# Altium project 恒温烤箱控制系统.PrjPCB
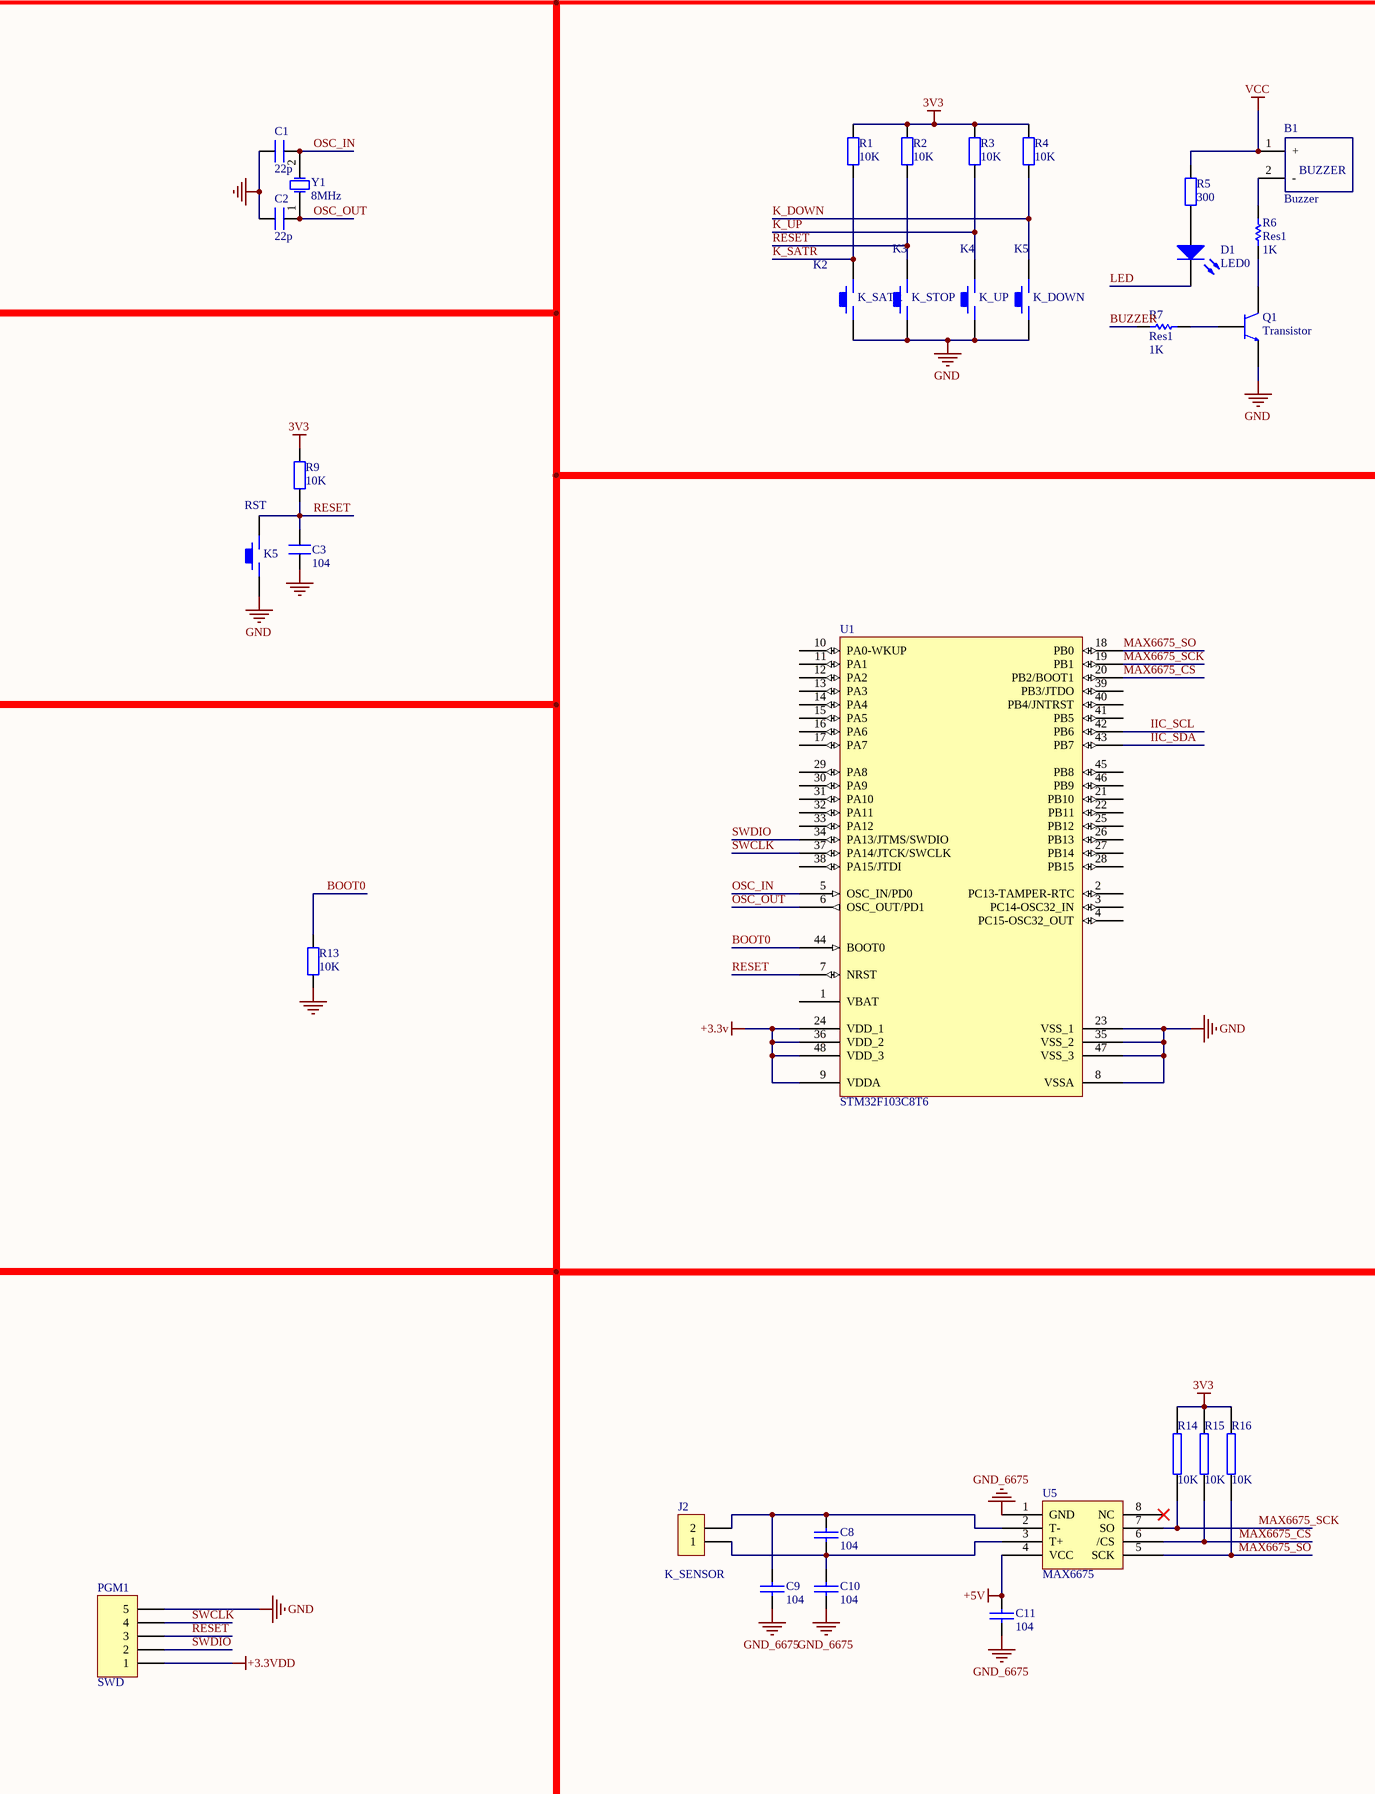
[diagram p0: 原理图.SchDoc, left]
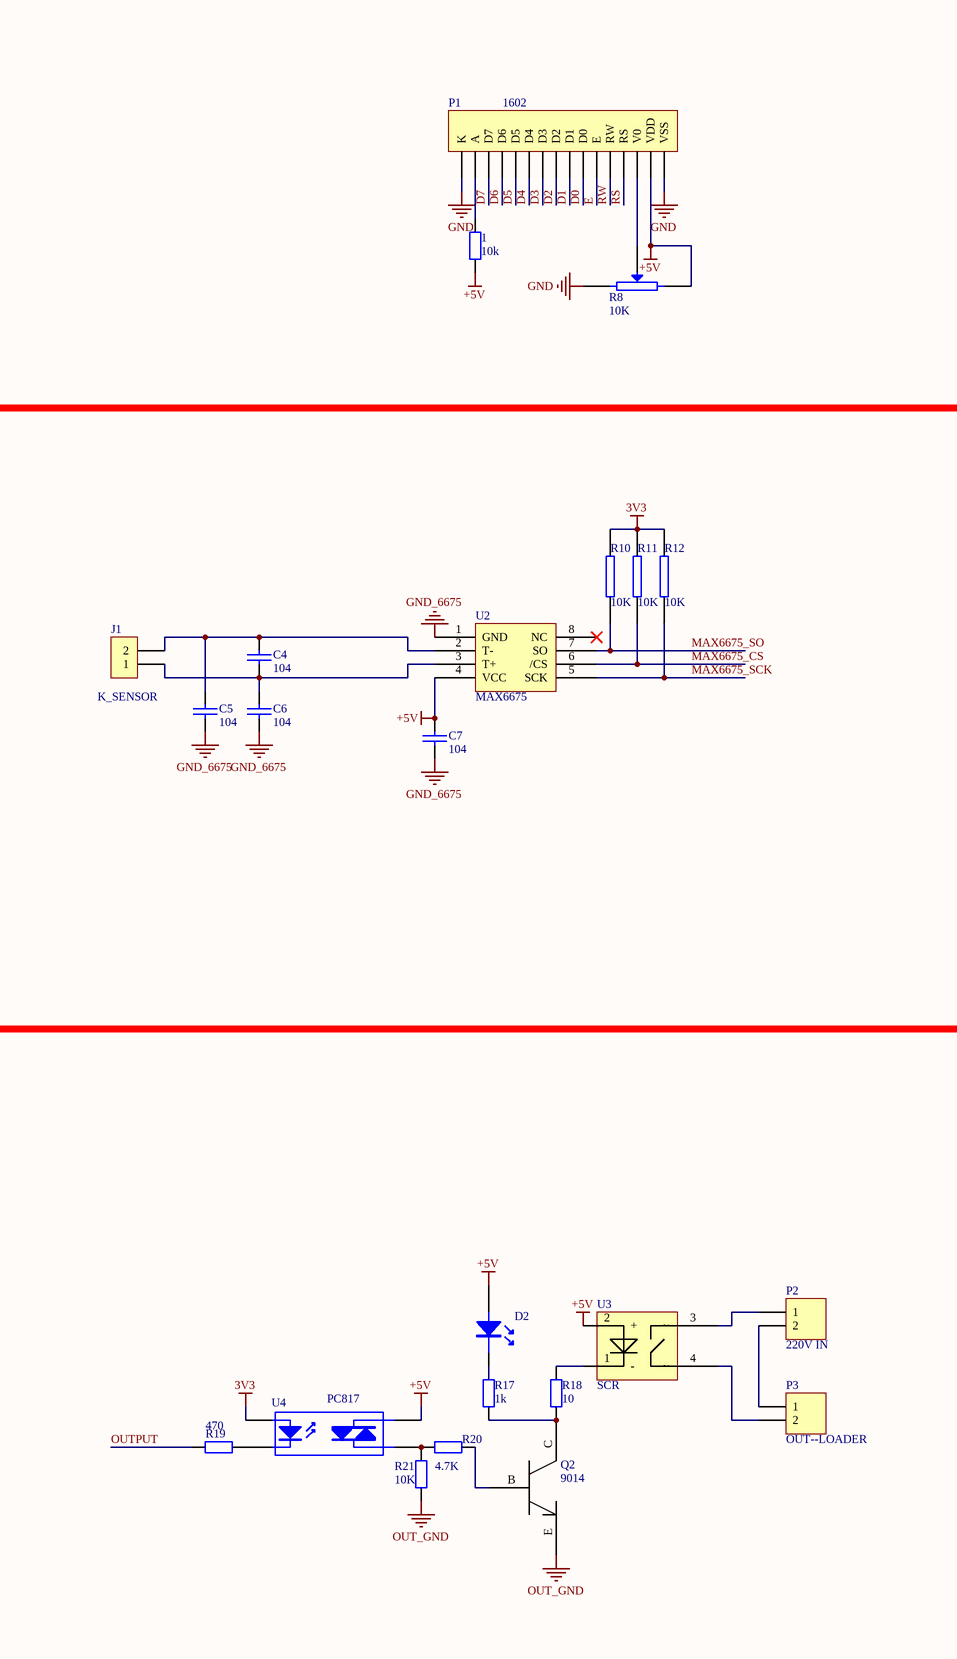
[diagram p1: 原理图.SchDoc, right]
1 sheet, 55 parts. Net scope: global (net labels, ports and power ports of the same name join across sheets).
Board file: PCB.PcbDoc

## Sheet 原理图.SchDoc
size A2

### Parts
1  10k  [AXIAL-0.4]
B1  Buzzer  [BUZZER]
C1  22p  [1206]
C2  22p  [1206]
C3  104  [1206]
C4  104  [1206]
C5  104  [1206]
C6  104  [1206]
C7  104  [1206]
C8  104  [1206]
C9  104  [1206]
C10  104  [1206]
C11  104  [1206]
D1  LED0  [LED-0]
D2  (no value)  [LED]
J1  K_SENSOR  [OUT_CJ]
J2  K_SENSOR  [OUT_CJ]
K5  RST  [KEY_M]
K_DOWN  K5  [KEY_M]
K_SATR  K2  [KEY_M]
K_STOP  K3  [KEY_M]
K_UP  K4  [KEY_M]
P1  1602  [HDR1X16]
P2  220V IN  [OUT_CJ]
P3  OUT--LOADER  [OUT_CJ]
PGM1  SWD  [HX2.54-5p]
Q1  Transistor  [SOT23_TR]
Q2  9014  [9014]
R1  10K  [1206]
R2  10K  [1206]
R3  10K  [1206]
R4  10K  [1206]
R5  300  [AXIAL-0.4]
R6  Res1  value 1K  [SMD0805_RES]
R7  Res1  value 1K  [SMD0805_RES]
R8  10K  [VR]
R9  10K  [1206]
R10  10K  [1206]
R11  10K  [1206]
R12  10K  [1206]
R13  10K  [1206]
R14  10K  [1206]
R15  10K  [1206]
R16  10K  [1206]
R17  1k  [1206]
R18  10  [1206]
R19  470  [1206]
R20  4.7K  [1206]
R21  10K  [1206]
U1  STM32F103C8T6  [LQFP48_N]
U2  MAX6675  [SO-8]
U3  SCR  [SCR]
U4  PC817  [pc817]
U5  MAX6675  [SO-8]
Y1  8MHz  [XTAL_US]

### Nets
3V3: R1.2 R2.2 R3.2 R4.2 R9.1 R10.2 R11.2 R12.2 R14.2 R15.2 R16.2 U4.1(A)
+3.3v: U1.9(VDDA) U1.24(VDD_1) U1.36(VDD_2) U1.48(VDD_3)
+3.3VDD: PGM1.1
+5V: 1.1 C7.1 C11.1 D2.A P1.2(VDD) R8.2 U2.4(VCC) U3.2(+) U4.3(A/K) U5.4(VCC)
GND: C1.2 C2.1 C3.2 K5.1 K_DOWN.1 K_SATR.1 K_STOP.1 K_UP.1 P1.1(VSS) P1.16(K) PGM1.5 Q1.2 R8.1 R13.2 U1.8(VSSA) U1.23(VSS_1) U1.35(VSS_2) U1.47(VSS_3)
GND_6675: C5.2 C6.2 C7.2 C9.2 C10.2 C11.2 U2.1(GND) U5.1(GND)
OUT_GND: Q2.E R21.1
VCC: B1.1(+) R5.2
BOOT0: R13.1 U1.44(BOOT0)
BUZZER: R7.1
D0: P1.7(D0)
D1: P1.8(D1)
D2: P1.9(D2)
D3: P1.10(D3)
D4: P1.11(D4)
D5: P1.12(D5)
D6: P1.13(D6)
D7: P1.14(D7)
E: P1.6(E)
IIC_SCL: U1.42(PB6)
IIC_SDA: U1.43(PB7)
K_DOWN: K_DOWN.2 R4.1
K_SATR: K_SATR.2 R1.1
K_UP: K_UP.2 R3.1
LED: D1.2(K)
MAX6675_CS: R11.1 R15.1 U1.20(PB2/BOOT1) U2.6(/CS) U5.6(/CS)
MAX6675_SCK: R12.1 R14.1 U1.19(PB1) U2.5(SCK) U5.7(SO)
MAX6675_SO: R10.1 R16.1 U1.18(PB0) U2.7(SO) U5.5(SCK)
OSC_IN: C1.1 U1.5(OSC_IN/PD0) Y1.2(OSC2)
OSC_OUT: C2.2 U1.6(OSC_OUT/PD1) Y1.1(OSC1)
OUTPUT: R19.2
RESET: C3.1 K5.2 K_STOP.2 PGM1.3 R2.1 R9.2 U1.7(NRST)
RS: P1.4(RS)
RW: P1.5(RW)
SWCLK: PGM1.4 U1.37(PA14/JTCK/SWCLK)
SWDIO: PGM1.2 U1.34(PA13/JTMS/SWDIO)
Net1_2: 1.2 P1.15(A)
NetB1_2: B1.2(-) R6.2
NetC4_1: C4.1 C5.1 J1.2 U2.2(T-)
NetC4_2: C4.2 C6.1 J1.1 U2.3(T+)
NetC8_1: C8.1 C9.1 J2.2 U5.2(T-)
NetC8_2: C8.2 C10.1 J2.1 U5.3(T+)
NetD1_1: D1.1(A) R5.1
NetD2_K: D2.K R17.2
NetP1_3: P1.3(V0) R8.3(W)
NetP2_1: P2.1 U3.3
NetP2_2: P2.2 P3.1
NetP3_2: P3.2 U3.4
NetQ1_1: Q1.1 R7.2
NetQ1_3: Q1.3 R6.1
NetQ2_B: Q2.B R20.1
NetQ2_C: Q2.C R17.1 R18.1
NetR18_2: R18.2 U3.1(-)
NetR19_1: R19.1 U4.2(K)
NetR20_2: R20.2 R21.2 U4.4(A/K)

Not connected (* = marked no-connect by the designer): U1 1(VBAT) 2(PC13-TAMPER-RTC) 3(PC14-OSC32_IN) 4(PC15-OSC32_OUT) 10(PA0-WKUP) 11(PA1) 12(PA2) 13(PA3) 14(PA4) 15(PA5) 16(PA6) 17(PA7) 21(PB10) 22(PB11) 25(PB12) 26(PB13) 27(PB14) 28(PB15) 29(PA8) 30(PA9) 31(PA10) 32(PA11) 33(PA12) 38(PA15/JTDI) 39(PB3/JTDO) 40(PB4/JNTRST) 41(PB5) 45(PB8) 46(PB9); U2 8(NC)*; U5 8(NC)*

### Notes on the sheet
- (in symbol Buzzer) BUZZER

### Library data of the parts
1 R1-R5 R9 R13 R21 = Res2: Resistor; Published: 8-Jun-2000; LatestRevisionDate: 17-Jul-2002; LatestRevisionNote: Re-released for DXP Platform.; PackageReference: AXIAL-0.4; Publisher: Altium Limited; PackageDescription: Axial Device, Thru-Hole; 2 Leads; 0.4 in Pin Spacing
  R1-R4 R13 R21: Value: 10K
C1-C3 = C
C4-C11 = 普通电容: Capacitor
D1 = LED0: Typical INFRARED GaAs LED; Published: 8-Jun-2000; LatestRevisionDate: 08-Jul-2005; LatestRevisionNote: Mech Layer 1 removed.; PackageReference: LED-0; Publisher: Altium Limited; PackageDescription: LED; 2 Leads
D2 = 发光二极管
J1 J2 = CON2: Connector
K5 K_DOWN K_SATR K_STOP K_UP = KEY_M
P1 = Header 16: Header, 16-Pin; LatestRevisionDate: 17-Jul-2002; LatestRevisionNote: Re-released for DXP Platform.; Publisher: Altium Limited
P2 P3 = Header 2: Header, 2-Pin; LatestRevisionDate: 17-Jul-2002; LatestRevisionNote: Re-released for DXP Platform.; Publisher: Altium Limited
PGM1 = Header 5: Header, 5-Pin; LatestRevisionDate: 17-Jul-2002; LatestRevisionNote: Re-released for DXP Platform.; Publisher: Altium Limited
Q1 = NPN_Transistor_SOT23
R6 R7 = Res1: Resistor; Published: 8-Jun-2000; LatestRevisionDate: 17-Jul-2002; LatestRevisionNote: Re-released for DXP Platform.; PackageReference: AXIAL-0.3; Publisher: Altium Limited
R8 = RESVR: Potentiometer
R10-R12 R14-R16 = RES2
R17-R20 = Res2: Resistor; Value: 10K; Published: 8-Jun-2000; LatestRevisionDate: 17-Jul-2002; LatestRevisionNote: Re-released for DXP Platform.; PackageReference: AXIAL-0.4; Publisher: Altium Limited; PackageDescription: Axial Device, Thru-Hole; 2 Leads; 0.4 in Pin Spacing
U1 = STM32F103C8T6: STM32 ARM-based 32-bit MCU with 64 Kbytes Flash, 48-pin LQFP, Industrial Temperature; Published: 30-May-2008; DatasheetVersion: rev6, Mar-2008; PackageVersion: Mar-2008; PackageReference: LQFP48; Publisher: Altium Limited; PackageDescription: 48-Pin Low-Profile Quad Flat Pack, 7 x 7 mm Body, 0.5 mm Pitch (LQFP48); ComponentLink1Description: Manufacturer Link; ComponentLink1URL: www.st.com/stm32; ComponentLink2Description: Datasheet; ComponentLink2URL: http://www.st.com/stonline/products/literature/ds/13587.pdf
U4 = OPTOTRIAC
Y1 = XTAL: Crystal Oscillator; Published: 8-Jun-2000; LatestRevisionDate: 17-Jul-2002; LatestRevisionNote: Re-released for DXP Platform.; Publisher: Altium Limited